# Altium project soldeerbout 2.PrjPcb
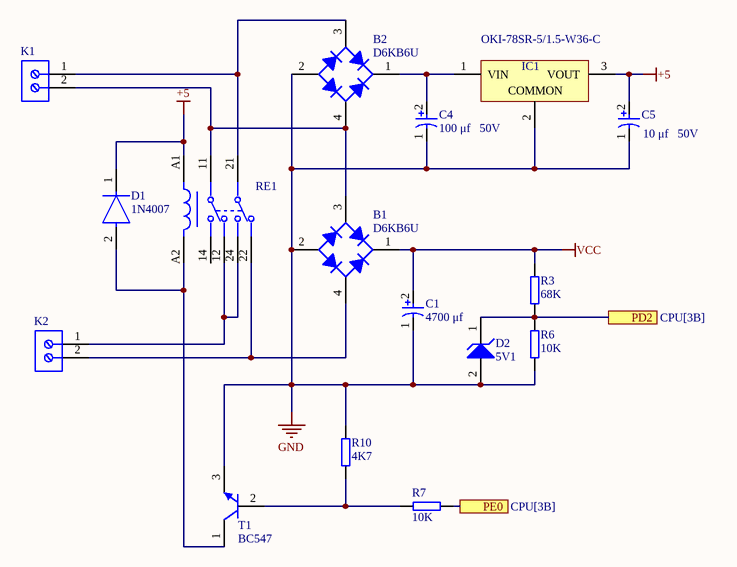
[diagram p0: voeding.SchDoc]
5 sheets, 76 parts. Net scope: flat (ports and power ports of the same name join across sheets).
Sheets:
  voeding.SchDoc
  CPU.SchDoc
  Display.SchDoc
  SolBout.SchDoc
  I2C.SchDoc

## Sheet voeding.SchDoc
size A4; SheetNumber: 1; SheetTotal: 5

### Parts
B1  D6KB6U  [ttf]
B2  D6KB6U  [ttf]
C1  4700 μf  [CE_D8_L10]
C4  100 μf   50V  [CE_D8_L10]
C5  10 μf   50V  [CE_D8_L10]
D1  1N4007  [SOD-123FL]
D2  5V1  [SOD-123FL]
IC1  OKI-78SR-5/1.5-W36-C  [OKI78SR515W36C]
K1  (no value)  [TECO-282836-2_V]
K2  (no value)  [TECO-282836-2_V]
R3  68K  [0805_M]
R6  10K  [0805_M]
R7  10K  [0805_M]
R10  4K7  [0805_M]
RE1  (no value)  [RT42]
T1  BC547  [SOT_23]

### Ports
PD2 (see CPU[3B]), PE0 (see CPU[3B])

### Nets
+5: C5.2 D1.1(C) IC1.3(VOUT) RE1.A1
GND: B1.2(A) B2.2(A) C1.1 C4.1 C5.1 D2.2(A) IC1.2(COMMON) R6.1 R10.2 T1.3(E)
VCC: B1.1(K) C1.2 R3.2
NetB1_3: B1.3(C) B2.4(C) K1.2 RE1.11
NetB1_4: B1.4(C) K2.2 RE1.22
NetB2_1: B2.1(K) C4.2 IC1.1(VIN)
NetB2_3: B2.3(C) K1.1 RE1.21
NetD1_2: D1.2(A) RE1.A2 T1.1(C)
NetD2_1: D2.1(K) R3.1 R6.2 ; port PD2
NetK2_1: K2.1 RE1.12 RE1.24
NetR7_1: R7.1 ; port PE0
NetR7_2: R7.2 R10.1 T1.2(B)

Not connected (* = marked no-connect by the designer): RE1 14

### Library data of the parts
B1 B2 = Bridge_Rectifier: Manufacturer: Diodes Inc; Average Rectified Current-Max: 0.8A; Reverse Voltage-Max [Vrrm]: 600V; Forward Voltage: 1V; Peak Current-Max: 30A; Reverse Current-Max: 5µA; Package Version: 05/2016; Package URL: http://www.diodes.com/_files/packages/MiniDIP.pdf; Datasheet Version: Rev. 13-2, 12/2010; Datasheet URL: http://www.diodes.com/_files/datasheets/ds17003.pdf; Mounting Technology: SurfaceMount; Manufacturer URL: http://www.diodes.com/; Package Reference: MiniDIP-4; Package Description: 4-Pin Small Outline Integrated Circuit, Body 4.7 x 3.8 mm, Pitch 2.5 mm
C1 C4 C5 = Capacitor_Electrolytic: Manufacturer: Panasonic; Voltage Rating: 25 V; ComponentLink2URL: http://industrial.panasonic.com/cdbs/www-data/pdf/RDE0000/ABA0000C1181.pdf; Height: 10.2 mm; Max Operating Temperature: 105 degC; PackageReference: EEE-FK1E221P; ComponentLink1Description: Manufacturer URL; ComponentLink1URL: http://www.panasonic.com/; Mount: Surface Mount; REACH SVHC: No SVHC; Min Operating Temperature: -55 degC; ComponentLink2Description: Datasheet; DatasheetVersion: 03/2016; Length: 10.2 mm; RoHSCompliant: true; Packaging: Tape and Reel; Package Quantity: 500; Lead Pitch: 3.1 mm; Pins: 2; PackageDescription: 2-Pin Electrolytic Aluminum Capacitor, Body 8.3 x 8.3 mm; Mounting Technology: Surface Mount
D1 = Diode: Manufacturer: Diotec; Max Surge Forward Current: 27A; Forward Current: 1A; Max Junction Temp: +175°C; Reverse Voltage: 1000V; Value: 15pF; Peak Reverse Current: 5uA; Category: Diode; Temperature Range Low: -50°C; Automotive: No; Temperature: -50°C to +175°C; Lead Free: Yes; ComponentLink2Description: Datasheet; Max Repetitive Reverse Voltage: 1000V; ComponentLink2URL: https://datasheet.octopart.com/1N4007-Diotec-datasheet-62346875.pdf; Manufacturer Part Number: 1N4007; Device Class L3: Rectifier Diodes; Height: 2.8mm; Octopart: https://octopart.com/1n4007-diotec-4040411; Package: 1N4007; Temperature Range High: +175°C; Device Class L1: Discrete Semiconductors; Device Class L2: Diodes; RoHS: TRUE; Capacitance: 15pF; Ipc Land Pattern Name: DIOAD888W100L520D280
D2 = Zener_Diode: Manufacturer: On Semiconductor; PartNumber: 1SMB5920BT3G; Packing: Tape and Reel; VZ Typ (V): 6.2; PackageDescription: 2-Pin Small Molded Package, J-Bend Lead, Body 4.33 x 3.625 mm; Mounting Technology: Surface Mount; PackageVersion: Rev. H, 05/2011; ComponentLink1Description: Manufacturer URL; RoHS: Pb-Free; DatasheetVersion: Rev. 8; ComponentLink2Description: Datasheet; ComponentLink2URL: http://www.onsemi.com/pub_link/Collateral/1SMB5913BT3-D.PDF; ComponentLink1URL: http://www.onsemi.com/; ComponentLink3Description: Package Specification; PackageReference: SMB-2-403A-03_H; ComponentLink3URL: http://www.onsemi.com/pub_link/Collateral/1SMB5913BT3-D.PDF
IC1 = DC/DC Converter: Manufacturer: Murata; Current - Output (Max): 1.5A; Power (Watts) - Max: 8W; Efficiency: 90.5%; Voltage - Input (Min): 7V; Voltage - Input (Max): 36V; Voltage - Output 1: 5V; Number of Outputs: 1; Package / Case: 3-SIPModule; Features: SCP; Type: LinearRegulatorReplacement; Size / Dimension: 0.41"Lx0.30"Wx0.65"H(10.4mmx7.6mmx16.5mm); Datasheet URL: https://datasheet.ciiva.com/8006/1790439-8006672.pdf; Datasheet Version: Oct-13; Power (Watts) - Manufacture Series: 8W; Voltage - Output 2: -; Series: Okami™OKI-78SR; Family: DCDCConverters; Manufacturer URL: http://www.murata.com/; Category: PowerSupplies-BoardMount; Voltage - Isolation: -; Packaging: Tube; Applications: ITE(Commercial); Mounting Type: ThroughHole; Voltage - Output 3: -; Operating Temperature: -40degC~85degC
K1 K2 = CMP-1684-00017-1: Female Header, Pitch 5 mm, 1 x 2 Position, Height 10 mm, Tail Length 3.5 mm, Rohs, Bulk; Manufacturer: TE Connectivity; Wire Gauge: 16-30AWG; Product Training Modules: Wire-to-BoardEurostyleTerminalBlocks; Clamp Material - Plating: Brass-NickelPlated; Voltage: 300V; Mating Orientation: HorizontalwithBoard; Current: 13.5A; Pitch: 0.197"(5.00mm); Screw Thread: M3; 3D Model: 282836-2.pdf; Other Names: 5ULV-02B / A98076; Dynamic Catalog: BuchananSeries; Number of Levels: 1; Torque - Screw: 0.68Nm(6Lb-In); Featured Product: EurostyleTerminalBlockConnectors; Positions Per Level: 2; Wire Termination: Screw-RisingCageClamp; Datasheet URL: http://www.te.com.cn/commerce/DocumentDelivery/DDEController?Action=showdoc&DocId=Catalog+Section%7F1308389_EUROSTYLE_TERMINAL_BLOCKS%7F0607%7Fpdf%7FEnglish%7FENG_CS_1308389_EUROSTYLE_TERMINAL_BLOCKS_0607.pdf%7F282836-2; Color: Green; Family: TerminalBlocks-WiretoBoard; RoHS Information: 282836-2StatementofCompliance; Standard Package: 300; Contact Material - Plating: Brass-TinPlated; Manufacturer URL: http://www.te.com; Housing Material: Polyamide(PA66),Nylon6/6; Features: Interlocking(Side); Package Description: Female Header, Pitch 5 mm, 1 x 2 Position, Height 10 mm, Tail Length 3.5 mm; Mounting Type: ThroughHole; Package Reference: THD; Packaging: Bulk; Series: Buchanan; Category: Connectors,Interconnects; Screw Material - Plating: Brass-NickelPlated
R3 R6 R7 R10 = Resistor: Manufacturer: Vishay Dale; Part Number: CRCW08050000Z0EA
RE1 = RELAY_GENERAL_PURPOSE: Manufacturer Part Number: RT424005; Manufacturer: TE Connectivity; Coil Power: 403mW; Throw Configuration: DPDT; Coil Voltage: 5V; Number Of Contacts: 2; Coil Resistance: 62Ω; Current Rating: 8A; Coil Type: Non-Latching; Category: Relay; Octopart: https://octopart.com/5-1393243-9-te+connectivity-41835766; Device Class L3: Power Relays; ComponentLink2URL: https://www.te.com/commerce/DocumentDelivery/DDEController?Action=showdoc&DocId=Data+Sheet%7FRT2%7F1014%7Fpdf%7FEnglish%7FENG_DS_RT2_1014.pdf%7F5-1393243-9; Ambient Temperature Range High: +85°C; ComponentLink2Description: Datasheet; Digikey Description: RELAY GENERAL PURPOSE DPDT 8A 5V; Package: RT424005; Automotive: No; Device Class L1: Electromechanical; Height: 15.7mm; Device Class L2: Relays; Ambient Temperature Range Low: -40°C; Mouser Description: General Purpose Relay, Rt2 Series, Power, Non Latching, Dpdt, 5 Vdc, 8 A Rohs Compliant: Yes; Lead Free: Yes; RoHS: TRUE
T1 = Transistor_NPN: Manufacturer: On Semiconductor; PartNumber: BC547C; IC Continuous (A): 0.1; fT Min (MHz): 150; Packing: Bulk Box; Polarity: NPN; Mounting Technology: Through Hole; ComponentLink1URL: http://www.onsemi.com/; ComponentLink1Description: Manufacturer URL; ComponentLink3URL: http://www.onsemi.cn/pub_link/Collateral/2N6426-D.PDF; DatasheetVersion: Rev. 7; PackageVersion: Rev. AM; RoHS: FALSE; ComponentLink2URL: http://www.onsemi.com/pub_link/Collateral/BC546-D.PDF; ComponentLink3Description: Package Specification; PackageDescription: 3-Pin Transistor Outline, Body 4.825 x 3.685 mm, Pitch 1.27 mm; PackageReference: TO-92-3-29-11_AM_SL; ComponentLink2Description: Datasheet

## Sheet CPU.SchDoc
size A4; SheetNumber: 2; SheetTotal: 5
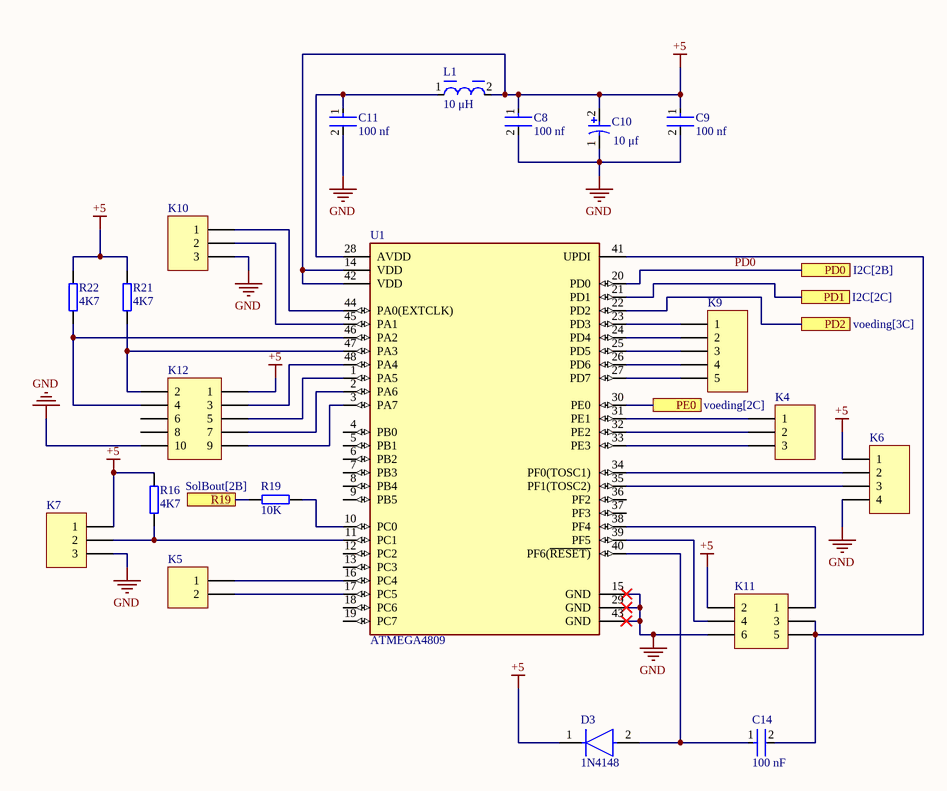
[diagram p1: CPU.SchDoc]

### Parts
C8  100 nf  [CC_0805_L]
C9  100 nf  [CC_0805_L]
C10  10 μf  [CE_D8_L10]
C11  100 nf  [CC_0805_L]
C14  100 nF  [CC_0805_L]
D3  1N4148  [SOD-123FL]
K4  (no value)  [HDR1X3]
K5  (no value)  [HDR1X2]
K6  (no value)  [HDR1X4]
K7  (no value)  [HDR1X3]
K9  (no value)  [HDR1X5]
K10  (no value)  [HDR1X3]
K11  (no value)  [HDR2X3]
K12  (no value)  [HDR2X5]
L1  10 μH  [CC_0805_L]
R16  4K7  [0805_M]
R19  10K  [0805_M]
R21  4K7  [0805_M]
R22  4K7  [0805_M]
U1  ATMEGA4809  [TQFP_48_M]

### Ports
PD0 (see I2C[2B]), PD1 (see I2C[2C]), PD2 (see voeding[3C]), PE0 (see voeding[2C]), R19 (see SolBout[2B])

### Nets
+5: C8.1 C9.1 C10.2 D3.1(C) K6.1 K7.1 K11.2 K12.1 L1.2 R16.2 R21.2 R22.2 U1.14(VDD) U1.42(VDD)
GND: C8.2 C9.2 C10.1 C11.2 K6.4 K7.3 K10.3 K11.6 K12.10 U1.15(GND) U1.29(GND) U1.43(GND)
PD0: U1.20(PD0) ; port PD0
NetC11_1: C11.1 L1.1 U1.28(AVDD)
NetC12_1: U1.21(PD1) ; port PD1
NetC14_1: C14.1 D3.2(A) U1.40(PF6(~{RESET)})
NetC14_2: C14.2 K11.3 K11.5 U1.41(UPDI)
NetD2_1: U1.22(PD2) ; port PD2
NetK4_1: K4.1 U1.31(PE1)
NetK4_2: K4.2 U1.32(PE2)
NetK4_3: K4.3 U1.33(PE3)
NetK5_1: K5.1 U1.16(PC4)
NetK5_2: K5.2 U1.17(PC5)
NetK6_2: K6.2 U1.34(PF0(TOSC1))
NetK6_3: K6.3 U1.35(PF1(TOSC2))
NetK7_2: K7.2 R16.1 U1.11(PC1)
NetK9_1: K9.1 U1.23(PD3)
NetK9_2: K9.2 U1.24(PD4)
NetK9_3: K9.3 U1.25(PD5)
NetK9_4: K9.4 U1.26(PD6)
NetK9_5: K9.5 U1.27(PD7)
NetK10_1: K10.1 U1.44(PA0(EXTCLK))
NetK10_2: K10.2 U1.45(PA1)
NetK11_1: K11.1 U1.38(PF4)
NetK11_4: K11.4 U1.39(PF5)
NetK12_2: K12.2 R21.1 U1.47(PA3)
NetK12_3: K12.3 U1.48(PA4)
NetK12_4: K12.4 R22.1 U1.46(PA2)
NetK12_5: K12.5 U1.1(PA5)
NetK12_7: K12.7 U1.2(PA6)
NetK12_9: K12.9 U1.3(PA7)
NetR7_1: U1.30(PE0) ; port PE0
NetR19_1: R19.1 ; port R19
NetR19_2: R19.2 U1.10(PC0)

Not connected (* = marked no-connect by the designer): K12 6 8; U1 4(PB0) 5(PB1) 6(PB2) 7(PB3) 8(PB4) 9(PB5) 12(PC2) 13(PC3) 18(PC6) 19(PC7) 36(PF2) 37(PF3)

### Library data of the parts
C8 C9 C11 C14 = Capacitor_Ceramic: Manufacturer: KEMET; Manufacturer Part Number: C0805C224K5RACTU; Value: 0.22 μF; Temperature Characteristic: X7R; Temperature Coefficient: 30ppm/°C; Tolerance: 0.1; Voltage Rating: 50 V; ComponentLink2URL: https://content.kemet.com/datasheets/KEM_C1003_C0G_SMD.pdf; Device Class L3: Ceramic Capacitors; Lead Free: Yes; Temperature: -55°C to +125°C; RoHS: TRUE; Capacitance: 0.22 μF; Automotive: No; Material: Ceramic; Octopart: https://octopart.com/c0805c224k5ractu-kemet-144670; Temperature Range Low: -55°C; Height: 0.88mm; Device Class L1: Passive Components; Digikey Description: CAP CER 0.22UF 50V X7R 0805; ComponentLink2Description: Datasheet; Mouser Description: CAP CER 0.22UF 50V X7R 0805; Category: Cap; Ipc Land Pattern Name: CAPC200125X78; Temperature Range High: +125°C; Package: C0805C-DN; Device Class L2: Capacitors
C10 = Capacitor_Electrolytic: as C1 on sheet voeding; ComponentLink2URL: http://industrial.panasonic.com/cdbs/www-data/pdf/RDE0000/ABA0000C1181.pdf; Height: 10.2 mm; Max Operating Temperature: 105 degC; PackageReference: EEE-FK1E221P; ComponentLink1Description: Manufacturer URL; ComponentLink1URL: http://www.panasonic.com/; Mount: Surface Mount; REACH SVHC: No SVHC; Min Operating Temperature: -55 degC; ComponentLink2Description: Datasheet; DatasheetVersion: 03/2016; Length: 10.2 mm; RoHSCompliant: true; Packaging: Tape and Reel; Package Quantity: 500; Lead Pitch: 3.1 mm; Pins: 2; PackageDescription: 2-Pin Electrolytic Aluminum Capacitor, Body 8.3 x 8.3 mm; Mounting Technology: Surface Mount
D3 = Diode: Manufacturer Part Number: 1N4007; Manufacturer: Diotec; Max Surge Forward Current: 27A; Forward Current: 1A; Max Junction Temp: +175°C; Reverse Voltage: 1000V; Value: 15pF; Peak Reverse Current: 5uA; Category: Diode; Temperature Range Low: -50°C; Automotive: No; Temperature: -50°C to +175°C; Lead Free: Yes; ComponentLink2Description: Datasheet; Max Repetitive Reverse Voltage: 1000V; ComponentLink2URL: https://datasheet.octopart.com/1N4007-Diotec-datasheet-62346875.pdf; Device Class L3: Rectifier Diodes; Height: 2.8mm; Octopart: https://octopart.com/1n4007-diotec-4040411; Package: 1N4007; Temperature Range High: +175°C; Device Class L1: Discrete Semiconductors; Device Class L2: Diodes; RoHS: TRUE; Capacitance: 15pF; Ipc Land Pattern Name: DIOAD888W100L520D280
K4 K7 K10 = Header 3: Header, 3-Pin; LatestRevisionDate: 17-Jul-2002; LatestRevisionNote: Re-released for DXP Platform.; Publisher: Altium Limited
K5 = Header 2: Header, 2-Pin; LatestRevisionDate: 17-Jul-2002; LatestRevisionNote: Re-released for DXP Platform.; Publisher: Altium Limited
K6 = Header 4: Header, 4-Pin; LatestRevisionDate: 17-Jul-2002; LatestRevisionNote: Re-released for DXP Platform.; Publisher: Altium Limited
K9 = Header 5: Header, 5-Pin; LatestRevisionDate: 17-Jul-2002; LatestRevisionNote: Re-released for DXP Platform.; Publisher: Altium Limited
K11 = Header 3X2: Header, 3-Pin, Dual row; LatestRevisionDate: 17-Jul-2002; LatestRevisionNote: Re-released for DXP Platform.; Publisher: Altium Limited
K12 = Header 5X2: Header, 5-Pin, Dual row; LatestRevisionDate: 17-Jul-2002; LatestRevisionNote: Re-released for DXP Platform.; Publisher: Altium Limited
L1 = Choke: Tolerance: 20%; Shielding: Shielded; Saturation Current: 10A; Test Frequency: 100kHz; RMS Current (Irms): 8.5A; Inductance: 10uH; Series Resistance: 14.1R; DC Resistance (DCR): 14.1mR; Self Resonant Frequency: 18MHz; Ratings: AEC-Q200; Width: 12.8mm; Series: WE-HCI; Length: 0.512inch; Mount: Surface Mount; Resistor Type: Wirewound; RoHS Compliant: Yes; Package Quantity: 1; Min Operating Temperature: -40°C; Inductance Tolerance: 20%; Termination: SMD/SMT; Max DC Current: 8.5A; Height - Seated (Max): 0.197inch; Case/Package: 1350; Current Rating: 8.5A; Max Operating Temperature: 155°C; Packaging: Tape and Reel; Height: 4.7mm
R16 R19 R21 R22 = Resistor: as R3 on sheet voeding
U1 = ATMEGA4809: Peripherals: Brown-out Detect/Reset; Number of I/Os: 41; Core Architecture: AVR; Memory Size: 48KB; Interface: I2C; Oscillator Type: Internal; Memory Type: FLASH; Series: megaAVR® 0, Functional Safety (FuSa); Min Operating Temperature: -40°C; Mount: Surface Mount; Case/Package: TQFP; RoHS Compliant: Yes; Max Operating Temperature: 85°C

## Sheet Display.SchDoc
size A4; SheetNumber: 3; SheetTotal: 5
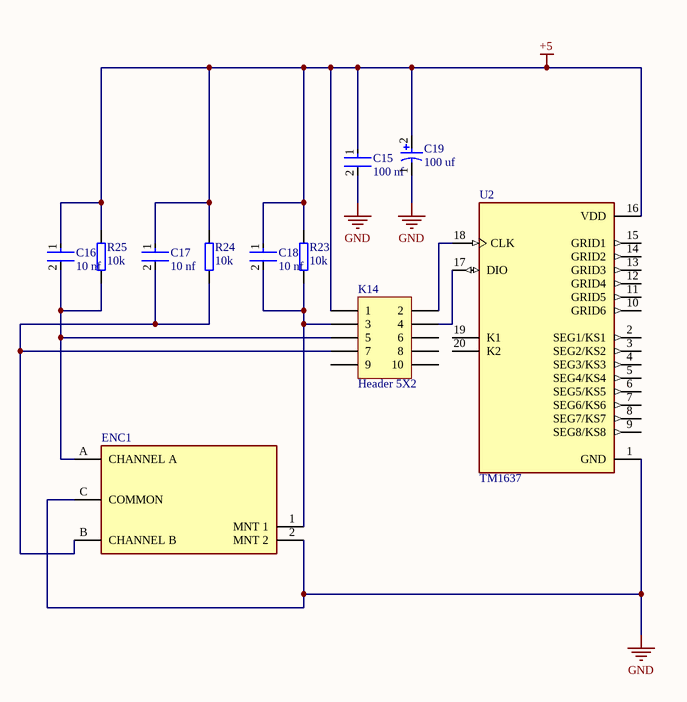
[diagram p2: Display.SchDoc]

### Parts
C15  100 nf  [CC_0805_L]
C16  10 nf  [CC_0805_L]
C17  10 nf  [CC_0805_L]
C18  10 nf  [CC_0805_L]
C19  100 uf  [CE_D8_L10]
ENC1  (no value)  [PEC11R4225FN0024]
K14  Header 5X2  [HDR2X5]
R23  10k  [0805_M]
R24  10k  [0805_M]
R25  10k  [0805_M]
U2  TM1637  [SOP_20_M]

### Nets
+5: C15.1 C16.1 C17.1 C18.1 C19.2 K14.1 R23.2 R24.2 R25.2 U2.16(VDD)
GND: C15.2 C19.1 ENC1.2(MNT_2) ENC1.C(COMMON) U2.1(GND)
NetC16_2: C16.2 ENC1.A(CHANNEL_A) K14.5 R25.1
NetC17_2: C17.2 ENC1.B(CHANNEL_B) K14.7 R24.1
NetC18_2: C18.2 ENC1.1(MNT_1) K14.3 R23.1
NetK14_2: K14.2 U2.18(CLK)
NetK14_4: K14.4 U2.17(DIO)

Not connected (* = marked no-connect by the designer): K14 6 8 9 10; U2 2(SEG1/KS1) 3(SEG2/KS2) 4(SEG3/KS3) 5(SEG4/KS4) 6(SEG5/KS5) 7(SEG6/KS6) 8(SEG7/KS7) 9(SEG8/KS8) 10(GRID6) 11(GRID5) 12(GRID4) 13(GRID3) 14(GRID2) 15(GRID1) 19(K1) 20(K2)

### Library data of the parts
C15-C18 = Capacitor_Ceramic: as C8 on sheet CPU; ComponentLink2URL: https://content.kemet.com/datasheets/KEM_C1003_C0G_SMD.pdf; Device Class L3: Ceramic Capacitors; Lead Free: Yes; Temperature: -55°C to +125°C; RoHS: TRUE; Capacitance: 0.22 μF; Automotive: No; Material: Ceramic; Octopart: https://octopart.com/c0805c224k5ractu-kemet-144670; Temperature Range Low: -55°C; Height: 0.88mm; Device Class L1: Passive Components; Digikey Description: CAP CER 0.22UF 50V X7R 0805; ComponentLink2Description: Datasheet; Mouser Description: CAP CER 0.22UF 50V X7R 0805; Category: Cap; Ipc Land Pattern Name: CAPC200125X78; Temperature Range High: +125°C; Package: C0805C-DN; Device Class L2: Capacitors
C19 = Capacitor_Electrolytic: as C1 on sheet voeding; ComponentLink2URL: http://industrial.panasonic.com/cdbs/www-data/pdf/RDE0000/ABA0000C1181.pdf; Height: 10.2 mm; Max Operating Temperature: 105 degC; PackageReference: EEE-FK1E221P; ComponentLink1Description: Manufacturer URL; ComponentLink1URL: http://www.panasonic.com/; Mount: Surface Mount; REACH SVHC: No SVHC; Min Operating Temperature: -55 degC; ComponentLink2Description: Datasheet; DatasheetVersion: 03/2016; Length: 10.2 mm; RoHSCompliant: true; Packaging: Tape and Reel; Package Quantity: 500; Lead Pitch: 3.1 mm; Pins: 2; PackageDescription: 2-Pin Electrolytic Aluminum Capacitor, Body 8.3 x 8.3 mm; Mounting Technology: Surface Mount
ENC1 = ROTARY_ENCODER: Manufacturer Part Number: PEC11R-4015F-N0024; Manufacturer: Bourns; Current Rating: 10mA; Number Of Circuits: 1; Conn Orientation: Vertical; Encoder Type: Incremental; Detent: No; Pulses Per Rev: 24; Voltage Rating Dc: 5V; Height: 22.3mm; ComponentLink2URL: https://www.bourns.com/docs/product-datasheets/pec11r.pdf?sfvrsn=bb617cbf_7; Mouser Description: Encoders 15mm SHAFT NO SWITCH; Package: 0; RoHS: TRUE; Temperature Range High: +70°C; Device Class L1: Electromechanical; Device Class L3: Encoders; Temperature Range Low: -30°C; Device Class L2: Switches; Temperature: -30°C to +70°C; Category: Enc; ComponentLink2Description: Datasheet; Lead Free: Yes; Automotive: No; Octopart: https://octopart.com/pec11r-4015f-n0024-bourns-26648251; Digikey Description: ROTARY ENCODER MECHANICAL 24PPR
K14 = Header 5X2: Header, 5-Pin, Dual row; LatestRevisionDate: 17-Jul-2002; LatestRevisionNote: Re-released for DXP Platform.; Publisher: Altium Limited
R23-R25 = Resistor: as R3 on sheet voeding
U2 = TM1637: LED Drive Control Special Circuit; MF: Titan Micro Electronics; Package: Package; Availability: Not in stock; SnapEDA_Link: https://www.snapeda.com/parts/TM1637/Titan+Micro+Electronics/view-part/?ref=snap; MP: TM1637; Check_prices: https://www.snapeda.com/parts/TM1637/Titan+Micro+Electronics/view-part/?ref=eda; Value: *; Price: None

## Sheet SolBout.SchDoc
size A4; SheetNumber: 4; SheetTotal: 5
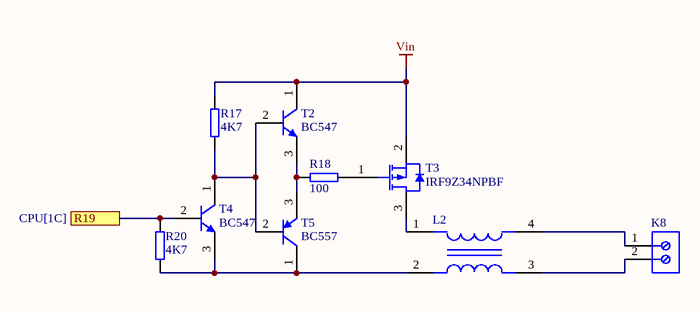
[diagram p3: SolBout.SchDoc]

### Parts
K8  (no value)  [TECO-282836-2_V]
L2  (no value)  [2545]
R17  4K7  [0805_M]
R18  100  [0805_M]
R20  4K7  [0805_M]
T2  BC547  [SOT_23]
T3  IRF9Z34NPBF  [TO_252]
T4  BC547  [SOT_23]
T5  BC557  [SOT_23]

### Ports
R19 (see CPU[1C])

### Nets
Vin: R17.2 T2.1(C) T3.2(SOURCE)
NetK8_1: K8.1 L2.4
NetK8_2: K8.2 L2.3
NetL2_1: L2.1 T3.3(DRAIN)
NetL2_2: L2.2 R20.1 T4.3(E) T5.1(C)
NetR17_1: R17.1 T2.2(B) T4.1(C) T5.2(B)
NetR18_1: R18.1 T2.3(E) T5.3(E)
NetR18_2: R18.2 T3.1(GATE)
NetR19_1: R20.2 T4.2(B) ; port R19

### Library data of the parts
K8 = CMP-1684-00017-1: as K1 on sheet voeding; Datasheet URL: http://www.te.com.cn/commerce/DocumentDelivery/DDEController?Action=showdoc&DocId=Catalog+Section%7F1308389_EUROSTYLE_TERMINAL_BLOCKS%7F0607%7Fpdf%7FEnglish%7FENG_CS_1308389_EUROSTYLE_TERMINAL_BLOCKS_0607.pdf%7F282836-2; Color: Green; Family: TerminalBlocks-WiretoBoard; RoHS Information: 282836-2StatementofCompliance; Standard Package: 300; Contact Material - Plating: Brass-TinPlated; Manufacturer URL: http://www.te.com; Housing Material: Polyamide(PA66),Nylon6/6; Features: Interlocking(Side); Package Description: Female Header, Pitch 5 mm, 1 x 2 Position, Height 10 mm, Tail Length 3.5 mm; Mounting Type: ThroughHole; Package Reference: THD; Packaging: Bulk; Series: Buchanan; Category: Connectors,Interconnects; Screw Material - Plating: Brass-NickelPlated
L2 = Common_Mode_Choke: Max Current Rating: 2A; Number of Lines: 2; Impedance: 900R; Element Configuration: Dual; Insulation Resistance: 10MR; Test Frequency: 100MHz; DC Resistance (DCR): 60mR; Voltage Rating (DC): 50V; Current Rating: 2.3A; Number of Pins: 4; DC Current: 2A; Mount: Surface Mount; Current: 2A; REACH SVHC: No SVHC; Width: 4.5mm; Case/Package: 1808; Voltage Rating: 50V; Package Quantity: 1; Height: 2mm; Max DC Current: 2A; Packaging: Tape and Reel; Max Operating Temperature: 85°C; Lead Free: Lead Free; Length: 0.185inch; Series: ACM; Radiation Hardening: No; Max Voltage Rating (DC): 50V; Termination: Flat; Depth: 4.7mm; RoHS Compliant: Yes; DC Resistance-Max: 60mR; Min Operating Temperature: -40°C
R17 R18 R20 = Resistor: as R3 on sheet voeding
T2 T4 = Transistor_NPN: as T1 on sheet voeding; Mounting Technology: Through Hole; ComponentLink1URL: http://www.onsemi.com/; ComponentLink1Description: Manufacturer URL; ComponentLink3URL: http://www.onsemi.cn/pub_link/Collateral/2N6426-D.PDF; DatasheetVersion: Rev. 7; PackageVersion: Rev. AM; RoHS: FALSE; ComponentLink2URL: http://www.onsemi.com/pub_link/Collateral/BC546-D.PDF; ComponentLink3Description: Package Specification; PackageDescription: 3-Pin Transistor Outline, Body 4.825 x 3.685 mm, Pitch 1.27 mm; PackageReference: TO-92-3-29-11_AM_SL; ComponentLink2Description: Datasheet
T3 = MOSFET_P: Manufacturer: Fairchild Semiconductor; Reel Quantity: 3000; Drain Source Voltage Vds: 20V; Power Dissipation Pd: 500mW; On Resistance Rds(on): 52mohm; Full Power Rating Temperature: 25°C; Voltage Vgs Max: -800mV; Pulse Current Idm: 10A; Rds(on) Test Voltage Vgs: -4.5V; External Depth: 2.5mm; Transistor Case Style: SOT-23; No. of Pins: 3; Continuous Drain Current Id: 2.4A; Voltage Vds Typ: -20V; Voltage Vgs th Max: -1.5V; Transistor Polarity: PChannel; Package Version: Rev. 3, 05/2015; External Width: 3.05mm; External Length / Height: 1.12mm; SMD Marking: 304P; SVHC: NoSVHC(19-Dec-2012); Termination Type: SMD; Datasheet URL: https://www.fairchildsemi.com/datasheets/FD/FDN304P.pdf; Tape Width: 8mm; Mounting Technology: SurfaceMount; Voltage Vgs Rds on Measurement: -4.5V; Operating Temperature Range: -55°Cto+150°C; Current Temperature: 25°C; Operating Temperature Min: -55°C; Threshold Voltage Vgs Typ: -800mV; Package / Case: SOT-23; Manufacturer URL: https://www.fairchildsemi.com/; Voltage Vds: 20V; Datasheet Version: Rev. C, 01/2001; Operating Temperature Max: 150°C; Package Description: 3-Pin Small Outline Transistor, Body 2.92 x 1.4 mm, Pitch 0.95 mm; Current Id Max: 2.4A; Package URL: https://www.fairchildsemi.com/package-drawings/MA/MA03B.pdf; Package Reference: SSOT3L
T5 = Transistor_PNP: Manufacturer: On Semiconductor; PartNumber: BC557C; Polarity: PNP; IC Continuous (A): -0.1; Packing: Bulk Box; PackageVersion: Rev. AM; RoHS: FALSE; PackageDescription: 3-Pin Transistor Outline, Body 4.825 x 3.685 mm, Pitch 1.27 mm; ComponentLink2Description: Datasheet; DatasheetVersion: Rev. 3; ComponentLink3Description: Package Specification; Mounting Technology: Through Hole; ComponentLink2URL: http://www.onsemi.com/pub_link/Collateral/BC556B-D.PDF; ComponentLink1URL: http://www.onsemi.com/; ComponentLink1Description: Manufacturer URL; ComponentLink3URL: http://www.onsemi.cn/pub_link/Collateral/2N6426-D.PDF; PackageReference: TO-92-3-29-11_AM_SL

## Sheet I2C.SchDoc
size A4; SheetNumber: 5; SheetTotal: 5
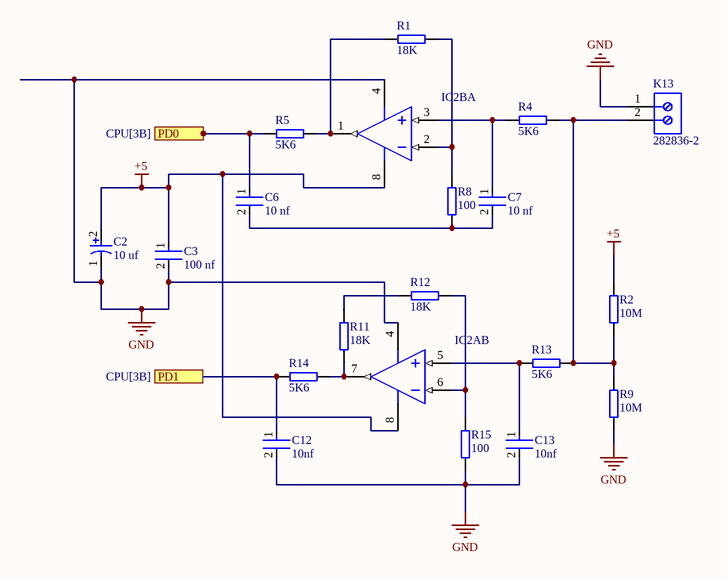
[diagram p4: I2C.SchDoc]

### Parts
C2  10 uf  [CE_D8_L10]
C3  100 nf  [CC_0805_L]
C6  10 nf  [CC_0805_L]
C7  10 nf  [CC_0805_L]
C12  10nf  [CC_0805_L]
C13  10nf  [CC_0805_L]
IC2A  (no value)  [MSOP_8_M]  (part B of 2)
IC2B  (no value)  [MSOP_8_M]  (part A of 2)
K13  282836-2  [TECO-282836-2_V]
R1  18K  [0805_M]
R2  10M  [0805_M]
R4  5K6  [0805_M]
R5  5K6  [0805_M]
R8  100  [0805_M]
R9  10M  [0805_M]
R11  18K  [0805_M]
R12  18K  [0805_M]
R13  5K6  [0805_M]
R14  5K6  [0805_M]
R15  100  [0805_M]

### Ports
PD0 (see CPU[3B]), PD1 (see CPU[3B])

### Nets
+5: C2.2 C3.1 IC2A.8(VDD) IC2B.8(VDD) R2.2
GND: C2.1 C3.2 C12.2 C13.2 IC2A.4(VSS) IC2B.4(VSS) K13.1 R9.1 R15.1
PD0: C6.1 R5.1 ; port PD0
NetC6_2: C6.2 C7.2 R8.1
NetC7_1: C7.1 IC2B.3(VINA+) R4.1
NetC12_1: C12.1 R14.1 ; port PD1
NetC13_1: C13.1 IC2A.5(VINB+) R13.1
NetIC2A_6: IC2A.6(VINB-) R12.2 R15.2
NetIC2A_7: IC2A.7(VOUTB) R11.1 R14.2
NetIC2B_1: IC2B.1(VOUTA) R1.1 R5.2
NetIC2B_2: IC2B.2(VINA-) R1.2 R8.2
NetK13_2: K13.2 R2.1 R4.2 R9.2 R13.2
NetR11_2: R11.2 R12.1

### Library data of the parts
C2 = Capacitor_Electrolytic: as C1 on sheet voeding; ComponentLink2URL: http://industrial.panasonic.com/cdbs/www-data/pdf/RDE0000/ABA0000C1181.pdf; Height: 10.2 mm; Max Operating Temperature: 105 degC; PackageReference: EEE-FK1E221P; ComponentLink1Description: Manufacturer URL; ComponentLink1URL: http://www.panasonic.com/; Mount: Surface Mount; REACH SVHC: No SVHC; Min Operating Temperature: -55 degC; ComponentLink2Description: Datasheet; DatasheetVersion: 03/2016; Length: 10.2 mm; RoHSCompliant: true; Packaging: Tape and Reel; Package Quantity: 500; Lead Pitch: 3.1 mm; Pins: 2; PackageDescription: 2-Pin Electrolytic Aluminum Capacitor, Body 8.3 x 8.3 mm; Mounting Technology: Surface Mount
C3 C6 C7 C12 C13 = Capacitor_Ceramic: as C8 on sheet CPU; ComponentLink2URL: https://content.kemet.com/datasheets/KEM_C1003_C0G_SMD.pdf; Device Class L3: Ceramic Capacitors; Lead Free: Yes; Temperature: -55°C to +125°C; RoHS: TRUE; Capacitance: 0.22 μF; Automotive: No; Material: Ceramic; Octopart: https://octopart.com/c0805c224k5ractu-kemet-144670; Temperature Range Low: -55°C; Height: 0.88mm; Device Class L1: Passive Components; Digikey Description: CAP CER 0.22UF 50V X7R 0805; ComponentLink2Description: Datasheet; Mouser Description: CAP CER 0.22UF 50V X7R 0805; Category: Cap; Ipc Land Pattern Name: CAPC200125X78; Temperature Range High: +125°C; Package: C0805C-DN; Device Class L2: Capacitors
IC2A IC2B = Dual_Opamp: Slew Rate: 0.6V/µs; Supply Current: 100uA; Power Supply Rejection Ratio (PSRR): 86dB; Input Offset Voltage (Vos): 4.5mV; Input Bias Current: 1pA; Amplifier Type: GENERAL PURPOSE; Unity Gain Bandwidth Product: 1MHz; Number of Circuits: 2; Output Current: 23mA; Operating Supply Voltage: 5.5V; Min Supply Voltage: 1.8V; Common Mode Rejection Ratio: 60dB; Voltage Gain: 112dB; Max Supply Voltage: 6V; Package Quantity: 60; REACH SVHC: No SVHC; Min Operating Temperature: -40°C; Max Operating Temperature: 125°C; Mount: Through Hole; Nominal Supply Current: 100uA; Height: 3.3mm; Length: 9.27mm; Slew Rate-Nom: 0.6V/µs; Packaging: Rail/Tube; Output Current per Channel: 23mA; Number of Amplifiers: 2; RoHS Compliant: Yes; Radiation Hardening: No; Bandwidth: 1MHz; Lead Free: Lead Free; Width: 6.35mm; Number of Channels: 2; Gain Bandwidth Product: 1MHz; Technology: CMOS; Operating Supply Current: 100uA; Number of Elements: 2; Number of Pins: 8; Input Offset Voltage-Max: 4.5mV; Case/Package: PDIP
K13 = CMP-1684-00017-1: as K1 on sheet voeding; Datasheet URL: http://www.te.com.cn/commerce/DocumentDelivery/DDEController?Action=showdoc&DocId=Catalog+Section%7F1308389_EUROSTYLE_TERMINAL_BLOCKS%7F0607%7Fpdf%7FEnglish%7FENG_CS_1308389_EUROSTYLE_TERMINAL_BLOCKS_0607.pdf%7F282836-2; Color: Green; Family: TerminalBlocks-WiretoBoard; RoHS Information: 282836-2StatementofCompliance; Standard Package: 300; Contact Material - Plating: Brass-TinPlated; Manufacturer URL: http://www.te.com; Housing Material: Polyamide(PA66),Nylon6/6; Features: Interlocking(Side); Package Description: Female Header, Pitch 5 mm, 1 x 2 Position, Height 10 mm, Tail Length 3.5 mm; Mounting Type: ThroughHole; Package Reference: THD; Packaging: Bulk; Series: Buchanan; Category: Connectors,Interconnects; Screw Material - Plating: Brass-NickelPlated
R1 R2 R4 R5 R8 R9 R11-R15 = Resistor: as R3 on sheet voeding

## Nets that join several sheets
+5: voeding (C5.2 D1.1 IC1.3 RE1.A1), CPU (14 pins), Display (10 pins), I2C (5 pins)
GND: voeding (10 pins), CPU (12 pins), Display (5 pins), I2C (9 pins)
NetC12_1: CPU (U1.21), I2C (C12.1 R14.1)
NetD2_1: voeding (D2.1 R3.1 R6.2), CPU (U1.22)
NetR7_1: voeding (R7.1), CPU (U1.30)
NetR19_1: CPU (R19.1), SolBout (R20.2 T4.2)
PD0: CPU (U1.20), I2C (C6.1 R5.1)